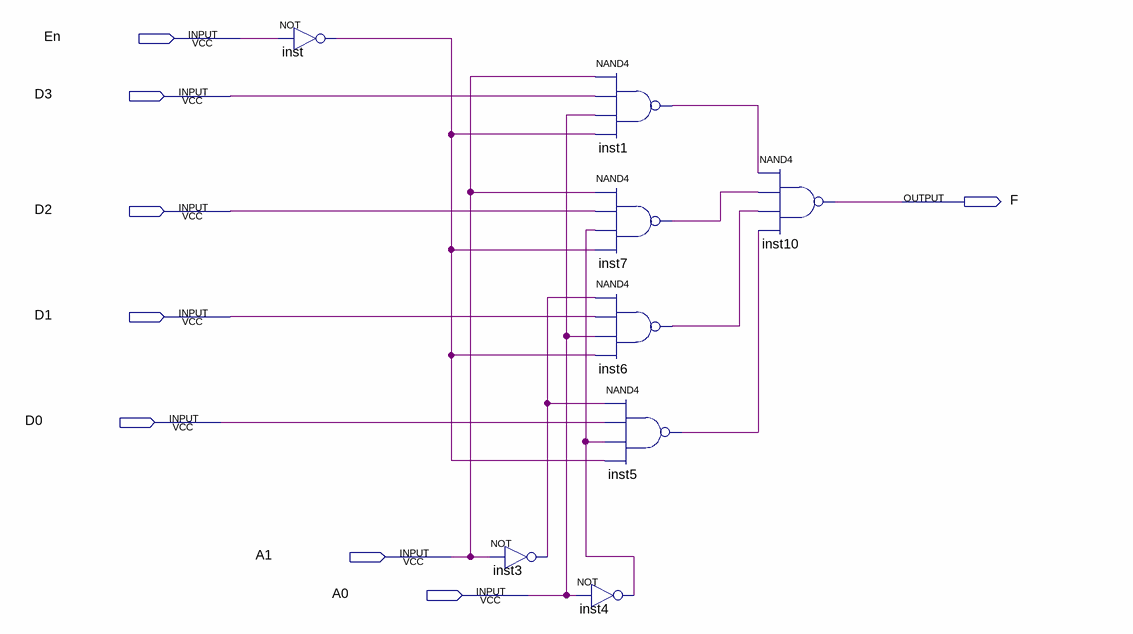
[diagram p0: schematic sheet]
// Quartus schematic mux41.bdf as structural Verilog: 8 symbols, 8 pins
module mux41 (
  input  En,
  input  D3,
  input  D2,
  input  D1,
  input  D0,
  input  A1,
  input  A0,
  output F
);

  wire inst1_out, inst3_out, inst4_out, inst5_out, inst6_out, inst7_out, inst_out;

  not inst (inst_out, En);
  not inst3 (inst3_out, A1);
  not inst4 (inst4_out, A0);
  nand inst1 (inst1_out, A1, D3, A0, inst_out);
  nand inst7 (inst7_out, A1, D2, inst4_out, inst_out);
  nand inst6 (inst6_out, inst3_out, D1, A0, inst_out);
  nand inst5 (inst5_out, inst3_out, D0, inst4_out, inst_out);
  nand inst10 (F, inst1_out, inst7_out, inst6_out, inst5_out);
endmodule
